# EAGLE schematic LCD Harness_B (EAGLE 6.5.0)
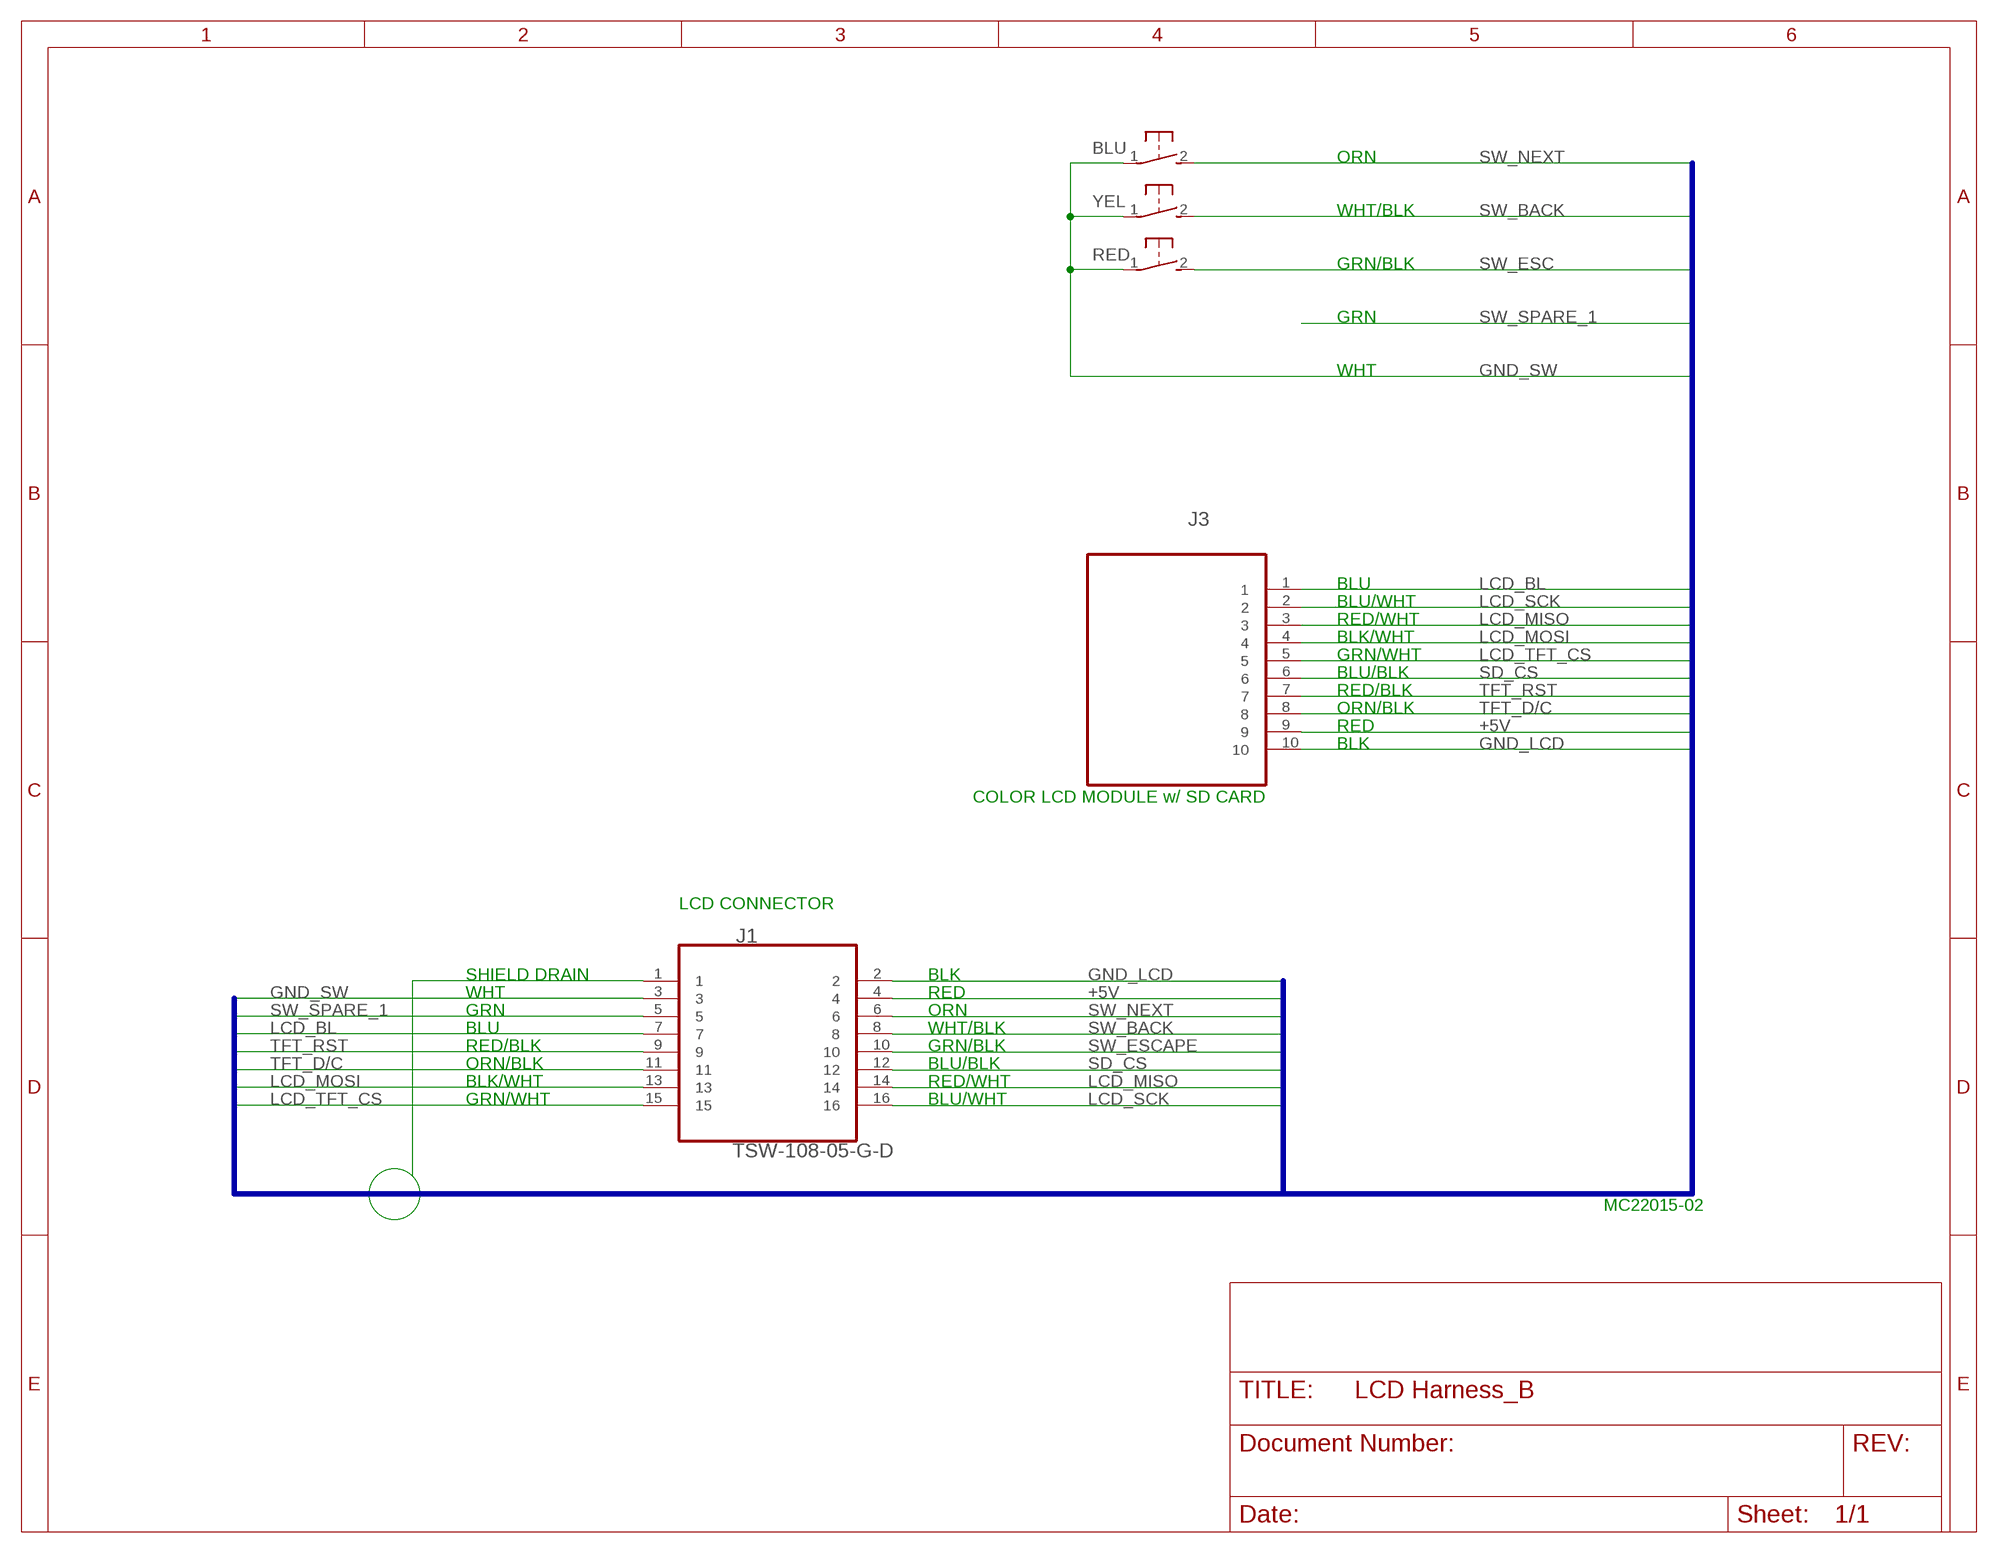
[diagram p0: schematic, sheet 1]

## Parts
BLU  31-XX  [B3F-31XX]
J1  TSW-108-05-G-D  [SAMTEC_TSW-108-05-G-D]
J3  TSW-110-08-L-S-RA  [SAMTEC_TSW-110-08-L-S-RA]
RED  31-XX  [B3F-31XX]
YEL  31-XX  [B3F-31XX]

## Nets
+5V: J1.4 J3.9
GND_LCD: J1.2 J3.10
GND_SW: BLU.1(P) J1.3 RED.1(P) YEL.1(P)
LCD_BL: J1.7 J3.1
LCD_MISO: J1.14 J3.3
LCD_MOSI: J1.13 J3.4
LCD_SCK: J1.16 J3.2
LCD_TFT_CS: J1.15 J3.5
N$1: J1.1
SD_CS: J1.12 J3.6
SW_BACK: J1.8 YEL.2(S)
SW_ESC: RED.2(S)
SW_ESCAPE: J1.10
SW_NEXT: BLU.2(S) J1.6
SW_SPARE_1: J1.5
TFT_D/C: J1.11 J3.8
TFT_RST: J1.9 J3.7

## Buses
B$1
B$2

## Notes on the sheet
- ORN
- WHT/BLK
- GRN/BLK
- GRN
- WHT
- BLU
- BLU/WHT
- RED/WHT
- BLK/WHT
- GRN/WHT
- BLU/BLK
- RED/BLK
- ORN/BLK
- RED
- BLK
- COLOR LCD MODULE w/ SD CARD
- LCD CONNECTOR
- SHIELD DRAIN | BLK
- WHT | RED
- GRN | ORN
- BLU | WHT/BLK
- RED/BLK | GRN/BLK
- ORN/BLK | BLU/BLK
- BLK/WHT | RED/WHT
- GRN/WHT | BLU/WHT
- MC22015-02

## Library data of the parts
BLU RED YEL = switch-omron:31-XX: OMRON SWITCH; MPN: B3F-3100; OC_FARNELL: 959704; OC_NEWARK: 36M3582
J1 = SAMTEC-TSW-xxx-D_By_element14_Batch_1:TSW-108-05-G-D: Through Hole Post Header; MPN: TSW-108-05-G-D; OC_FARNELL: 2024644; OC_NEWARK: 12P1639; PACKAGE: Post header-16Pin; SUPPLIER: Samtec
J3 = SAMTEC_TSW-XXX-S-X_By_element14_Batch_1:TSW-110-08-L-S-RA: CONN HEADER, 2.54MM, THT, R/A, 10WAY; MPN: TSW-110-08-L-S-RA; OC_FARNELL: 2041530; OC_NEWARK: 12P1805; PACKAGE: HEADER, 2.54MM, THT, R/A, 10WAY; SUPPLIER: Samtec